# EAGLE schematic 10+12-Bit RasPi-ADC_HAT v21 (EAGLE 8.2.2)
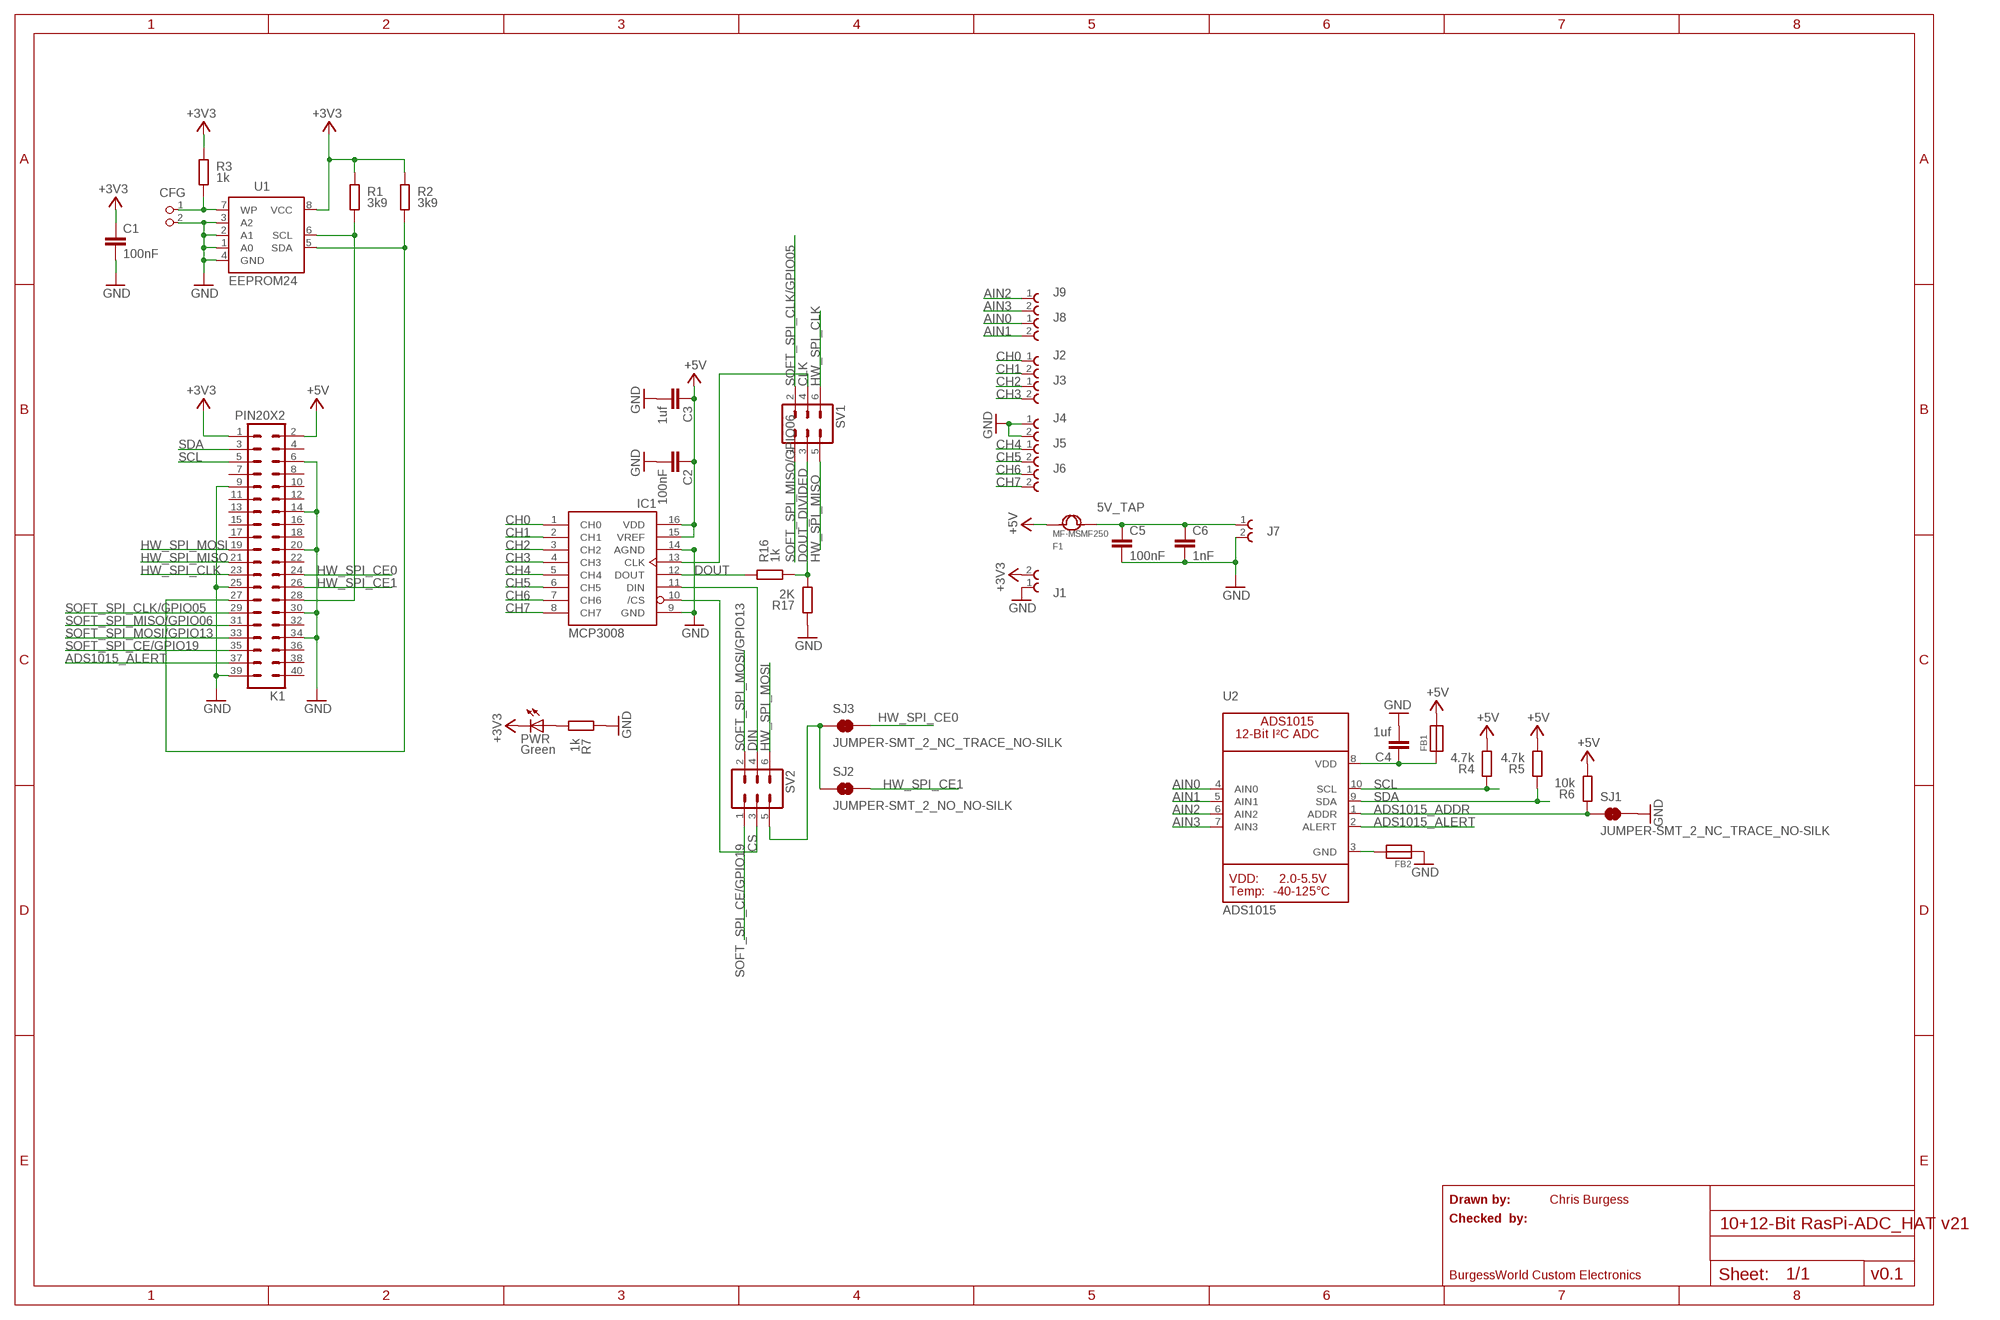
[diagram p0: schematic, sheet 1]

## Parts
C1  100nF  C-EUC0805K  [C0805K]
C2  100nF  C-EUC0805K  [C0805K]
C3  1uf  C-EUC0805K  [C0805K]
C4  1uf  C-EUC0805K  [C0805K]
C5  100nF  C-EUC0805K  [C0805K]
C6  1nF  C-EUC0805K  [C0805K]
CFG  PIN2_100  [PIN_W_2]
F1  MF-MSMF250  SMD-PPTC-USE-PPTC-0.50A-15V-0.15OHM(1812)  [F1812]
FB1  FERRITE0805  [0805]
FB2  FERRITE0805  [0805]
IC1  MCP3008  [DIL16]
J1  691214110002  [691214110002]
J2  691214110002  [691214110002]
J3  691214110002  [691214110002]
J4  691214110002  [691214110002]
J5  691214110002  [691214110002]
J6  691214110002  [691214110002]
J7  691214110002  [691214110002]
J8  691214110002  [691214110002]
J9  691214110002  [691214110002]
K1  PIN20X2  [PIN_20X2]
PWR  Green  LEDCHIPLED_0805  [CHIPLED_0805]
R1  3k9  R-EU_M0805  [M0805]
R2  3k9  R-EU_M0805  [M0805]
R3  1k  R-EU_M0805  [M0805]
R4  4.7k  R-EU_M0805  [M0805]
R5  4.7k  R-EU_M0805  [M0805]
R6  10k  R-EU_M0805  [M0805]
R7  1k  R-EU_M0805  [M0805]
R16  1k  R-EU_M0805  [M0805]
R17  2K  R-EU_M0805  [M0805]
SJ1  JUMPER-SMT_2_NC_TRACE_NO-SILK  [SMT-JUMPER_2_NC_TRACE_NO-SILK]
SJ2  JUMPER-SMT_2_NO_NO-SILK  [SMT-JUMPER_2_NO_NO-SILK]
SJ3  JUMPER-SMT_2_NC_TRACE_NO-SILK  [SMT-JUMPER_2_NC_TRACE_NO-SILK]
SV1  MA03-2  [MA03-2]
SV2  MA03-2  [MA03-2]
U1  EEPROM24  [SOIC8]
U2  ADS1015  ADC_ADS1015  [MSOP10]

## Nets
5V_TAP: C5.1 C6.1 F1.2 J7.1
+3V3: C1.1 J1.2 K1.1 PWR.C R1.2 R2.2 R3.2 U1.8(VCC)
+5V: C2.1 C3.1 F1.1 FB1.2 IC1.15(VREF) IC1.16(VDD) K1.2 R4.1 R5.1 R6.1
ADS1015_ADDR: R6.2 SJ1.1 U2.1(ADDR)
ADS1015_ALERT: K1.37 U2.2(ALERT)
ADS1015_FB: FB2.2 U2.3(GND)
ADS1015_VDD: C4.1 FB1.1 U2.8(VDD)
AIN0: J8.1 U2.4(AIN0)
AIN1: J8.2 U2.5(AIN1)
AIN2: J9.1 U2.6(AIN2)
AIN3: J9.2 U2.7(AIN3)
CH0: IC1.1(CH0) J2.1
CH1: IC1.2(CH1) J2.2
CH2: IC1.3(CH2) J3.1
CH3: IC1.4(CH3) J3.2
CH4: IC1.5(CH4) J5.1
CH5: IC1.6(CH5) J5.2
CH6: IC1.7(CH6) J6.1
CH7: IC1.8(CH7) J6.2
CLK: IC1.13(CLK) SV1.4
CS: IC1.10(/CS) SV2.3
DIN: IC1.11(DIN) SV2.4
DOUT: IC1.12(DOUT) R16.2
DOUT_DIVIDED: R16.1 R17.1 SV1.3
EEPROM_PROG: CFG.1 R3.1 U1.7(WP)
GND: C1.2 C2.2 C3.2 C4.2 C5.2 C6.2 CFG.2 FB2.1 IC1.9(GND) IC1.14(AGND) J1.1 J4.1 J4.2 J7.2 K1.6 K1.9 K1.14 K1.20 K1.25 K1.30 K1.34 K1.39 R7.2 R17.2 SJ1.2 U1.1(A0) U1.2(A1) U1.3(A2) U1.4(GND)
HW_SPI_CE: SJ2.1 SJ3.1 SV2.5
HW_SPI_CE0: K1.24 SJ3.2
HW_SPI_CE1: K1.26 SJ2.2
HW_SPI_CLK: K1.23 SV1.6
HW_SPI_MISO: K1.21 SV1.5
HW_SPI_MOSI: K1.19 SV2.6
ID_SC_27: K1.27 R2.1 U1.5(SDA)
ID_SC_28: K1.28 R1.1 U1.6(SCL)
N$1: PWR.A R7.1
SCL: K1.5 R4.2 U2.10(SCL)
SDA: K1.3 R5.2 U2.9(SDA)
SOFT_SPI_CE/GPIO19: K1.35 SV2.1
SOFT_SPI_CLK/GPIO05: K1.29 SV1.2
SOFT_SPI_MISO/GPIO06: K1.31 SV1.1
SOFT_SPI_MOSI/GPIO13: K1.33 SV2.2
Unconnected: K1.4 K1.7 K1.8 K1.10 K1.11 K1.12 K1.13 K1.15 K1.16 K1.17 K1.18 K1.22 K1.32 K1.36 K1.38 K1.40

## Notes on the sheet
- Drawn by: | Chris Burgess
- Checked  by:
- BurgessWorld Custom Electronics | v0.1

## Library data of the parts
C1-C6 = resistor:C-EU: CAPACITOR, European symbol; DIELECTRIC: X7R
CFG = FLYFISH:PIN2
F1 = Seeed-Fuse-2016:SMD-PPTC-USE-PPTC-0.50A-15V-0.15OHM(1812): 307010040; MPN: MF-MSMF050-2; VALUE: MF-MSMF050-2
FB1 FB2 = Adafruit_ADS1015_12Bit_I2C_ADC:FERRITE: Ferrite Bead 0603 MMZ1608B121C - 120 Ohm, 600mA Ferrite Chip - Digikey: 445-2164-1-ND BK1608HW121-T - 120 Ohm, 600mA Ferrite Chip - Digikey: 587-1876-2-ND 0805 HZ0805B272R-10 - 2.7K Ohm @ 100MHz, 200mA 0.8 Ohm DC Resistance - Digikey: 240-2504-1-ND (see also Murata BLM21BD272SN1L)
IC1 = adafruit:MCP3008
J1-J9 = Wurth_Elektronik_Electromechanic_Terminal_Blocks_Connectors_rev16e:691214110002: WR-TBL Serie 2141 - 3.5mm Horizontal Entry Modular with Rising Cage Clamp - 1.3 mm2 Wires, 2 Pins=>Code : Con_TBL_Screw_RisingClamp_3.50_691214110002 <http://katalog.we-online.de/media/images/eican/Con_TBL_Screw_RisingClamp_3.50_6912141100xx_pf2.jpg> Details see: http://katalog.we-online.de/en/em/TBL_3_50_2141_HORIZONTAL_ENTRY_MODULAR_69121411000X Created 2014-06-18, Karrer Zheng 2014 (C) Würth Elektronik
K1 = FLYFISH:PIN20X2
PWR = adafruit:LED: LED OSRAM: - CHIPLED LG R971, LG N971, LY N971, LG Q971, LY Q971, LO R971, LY R971 LH N974, LH R974 LS Q976, LO Q976, LY Q976 LO Q996 - Hyper CHIPLED LW Q18S LB Q993, LB Q99A, LB R99A - SideLED LS A670, LO A670, LY A670, LG A670, LP A670 LB A673, LV A673, LT A673, LW A673 LH A674 LY A675 LS A676, LA A676, LO A676, LY A676, LW A676 LS A679, LY A679, LG A679 - Hyper Micro SIDELED® LS Y876, LA Y876, LO Y876, LY Y876 LT Y87S - SmartLED LW L88C, LW L88S LB L89C, LB L89S, LG L890 LS L89K, LO L89K, LY L89K LS L896, LA L896, LO L896, LY L896 - TOPLED LS T670, LO T670, LY T670, LG T670, LP T670 LSG T670, LSP T670, LSY T670, LOP T670, LYG T670 LG T671, LOG T671, LSG T671 LB T673, LV T673, LT T673, LW T673 LH T674 LS T676, LA T676, LO T676, LY T676, LB T676, LH T676, LSB T676, LW T676 LB T67C, LV T67C, LT T67C, LS T67K, LO T67K, LY T67K, LW E67C LS E67B, LA E67B, LO E67B, LY E67B, LB E67C, LV E67C, LT E67C LW T67C LS T679, LY T679, LG T679 LS T770, LO T770, LY T770, LG T770, LP T770 LB T773, LV T773, LT T773, LW T773 LH T774 LS E675, LA E675, LY E675, LS T675 LS T776, LA T776, LO T776, LY T776, LB T776 LHGB T686 LT T68C, LB T68C - Hyper Mini TOPLED® LB M676 - Mini TOPLED Santana® LG M470 LS M47K, LO M47K, LY M47K Source: http://www.osram.convergy.de/
R1-R7 R16 R17 = resistor:R-EU_: RESISTOR, European symbol; TOLERANCE: 5%
SJ1 SJ3 = SparkFun-Jumpers:JUMPER-SMT_2_NC_TRACE: Normally closed trace jumper This jumper has a trace between two pads so it's normally closed (NC). Use a razor knife to open the connection. For best results follow the IPC guidelines for cutting traces: Cutout at least 0.063 mm (0.005 in). Remove all loose material to clean up the cut area. Seal the cut with an approved epoxy. Reapply solder to reclose the connection.
SJ2 = SparkFun-Jumpers:JUMPER-SMT_2_NO: Normally open jumper This jumper has two pads in close proximity to each other. Apply solder to close the connection. Round pads are easier to solder for beginners, but are a lot larger. SparkFun Product that uses the round pads: SparkFun EL Sequencer <https://www.sparkfun.com/products/12781>
SV1 SV2 = my-custom-lib:MA03-2: PIN HEADER; OC_FARNELL: unknown; OC_NEWARK: unknown
U1 = FLYFISH:EEPROM24
U2 = Adafruit_ADS1015_12Bit_I2C_ADC:ADC_ADS1015: ADS1015 - 12-bit 4-Channel I2C ADC with Internal PGA VDD: 2.0-5.5V Sampling Rate: 3.3ksps Gain Settings: 2/3, 1, 2, 4, 8, 16 I2C Address: ADDR low = 1001000x, ADDR high = 1001001x Internal Comparator The ADS1015 includes an internal comparator that can be set to output a high-level on ALERT when the conversion results exceeeds a pre-defined upper level, and will deassert itself when the level falls below a pre-defined lower threshold level. It can also be set to windowed mode where the ALERT pin will be asserted if the data exceeds the upper threshold or falls below the lower threshold.